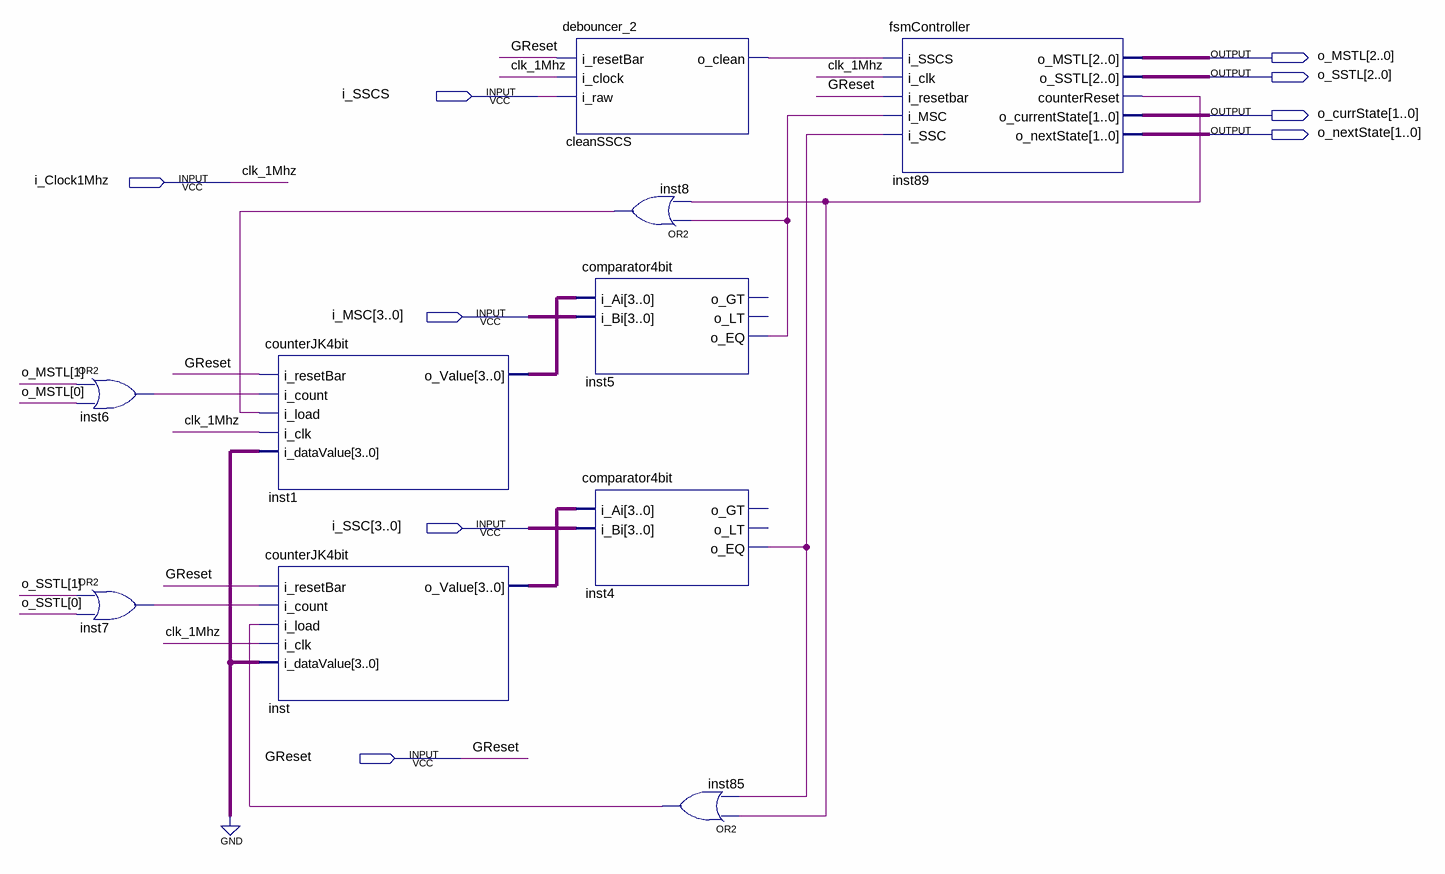
[diagram p0: schematic sheet]
// Quartus schematic lab3.bdf as structural Verilog: 10 symbols, 9 pins
module lab3 (
  input  i_SSCS,
  input  i_Clock1Mhz,
  input  [3:0] i_MSC,
  input  [3:0] i_SSC,
  input  GReset,
  output [2:0] o_MSTL,
  output [2:0] o_SSTL,
  output [1:0] o_currState,
  output [1:0] o_nextState
);

  wire cleanSSCS_o_clean, inst4_o_eq, inst5_o_eq, inst6_out, inst7_out, inst8_out, inst85_out,
       inst89_counterreset;
  wire [3:0] inst1_o_value, inst_o_value;

  or inst6 (inst6_out, o_MSTL[1], o_MSTL[0]);
  or inst7 (inst7_out, o_SSTL[1], o_SSTL[0]);
  counterJK4bit inst1 (
    .i_resetBar(GReset), .i_count(inst6_out), .i_load(inst8_out), .i_clk(i_Clock1Mhz), .i_dataValue(4'b0000),
    .o_Value(inst1_o_value));
  counterJK4bit inst (
    .i_resetBar(GReset), .i_count(inst7_out), .i_load(inst85_out), .i_clk(i_Clock1Mhz),
    .i_dataValue(4'b0000), .o_Value(inst_o_value));
  debouncer_2 cleanSSCS (.i_resetBar(GReset), .i_clock(i_Clock1Mhz), .i_raw(i_SSCS), .o_clean(cleanSSCS_o_clean));
  or inst8 (inst8_out, inst5_o_eq, inst89_counterreset);
  comparator4bit inst5 (.i_Ai(inst1_o_value), .i_Bi(i_MSC), .o_EQ(inst5_o_eq));  // open: o_GT, o_LT
  comparator4bit inst4 (.i_Ai(inst_o_value), .i_Bi(i_SSC), .o_EQ(inst4_o_eq));  // open: o_GT, o_LT
  or inst85 (inst85_out, inst89_counterreset, inst4_o_eq);
  fsmController inst89 (
    .i_SSCS(cleanSSCS_o_clean), .i_clk(i_Clock1Mhz), .i_resetbar(GReset), .i_MSC(inst5_o_eq),
    .i_SSC(inst4_o_eq), .o_MSTL(o_MSTL), .o_SSTL(o_SSTL), .counterReset(inst89_counterreset),
    .o_currentState(o_currState), .o_nextState(o_nextState));

  // Other names for the same wires on the sheet: clk_1Mhz = i_Clock1Mhz
endmodule
